# EAGLE schematic PIC32 (EAGLE 7.5.0)
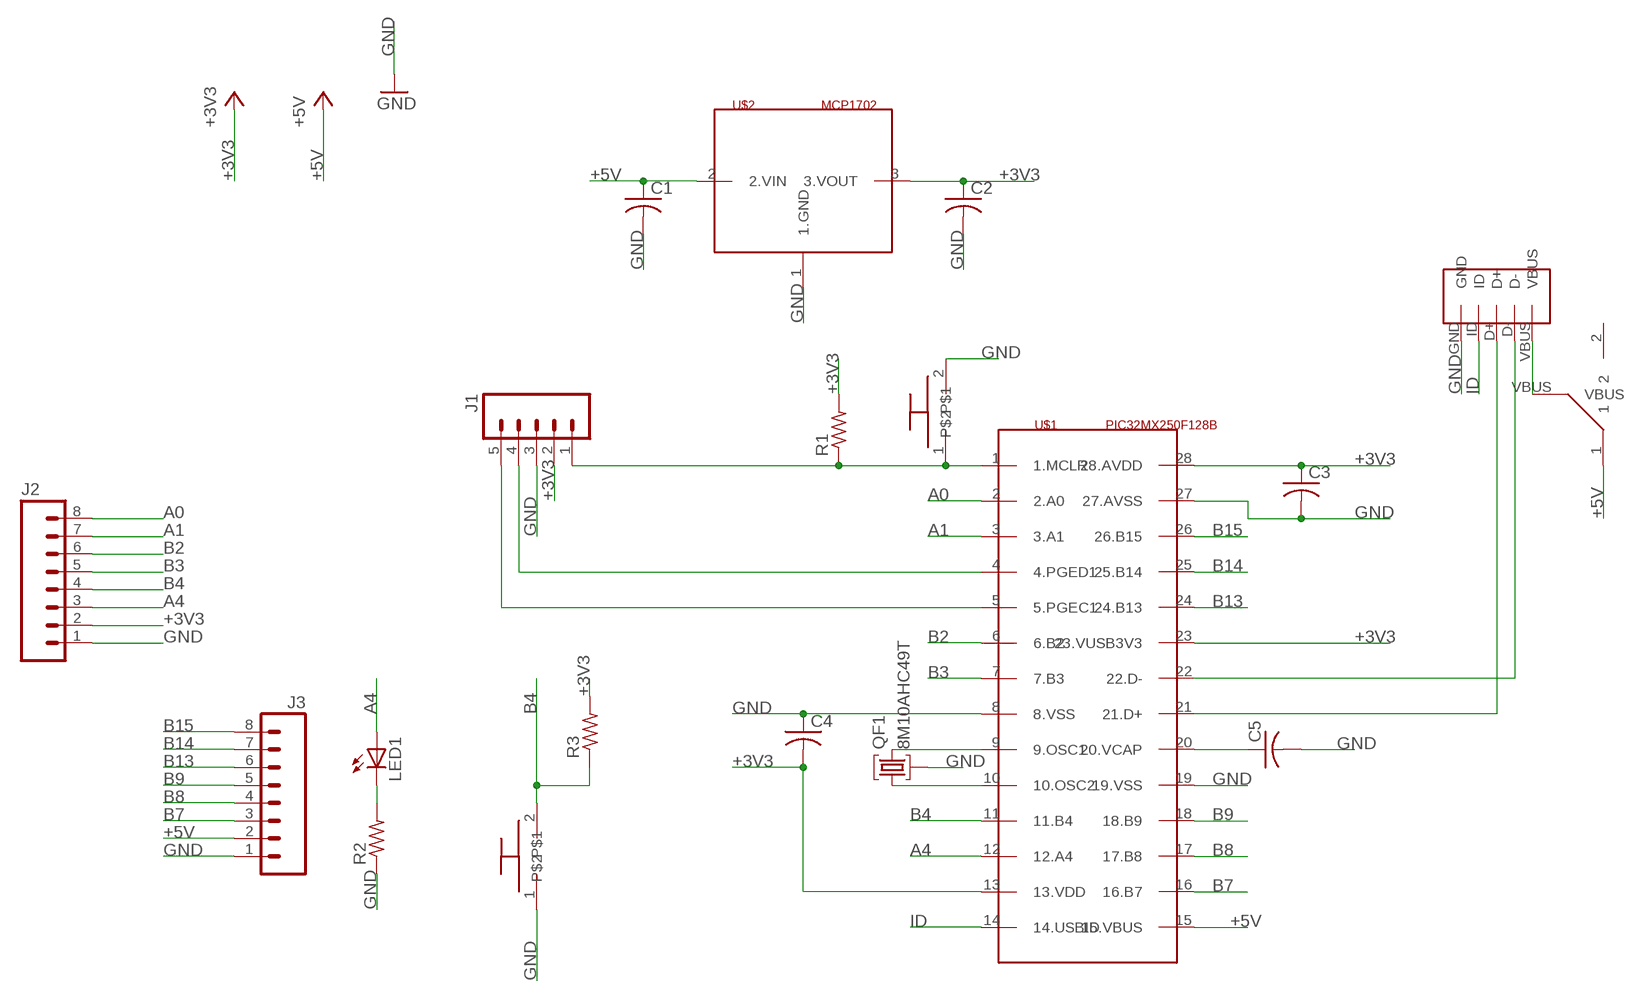
[diagram p0: schematic, sheet 1]

## Parts
C1  C-US025-024X044  [C025-024X044]
C2  C-US025-024X044  [C025-024X044]
C3  C-US025-024X044  [C025-024X044]
C4  C-US025-024X044  [C025-024X044]
C5  C-US025-030X050  [C025-030X050]
J1  M05PTH  [1X05]
J2  M08  [1X08_ROUND]
J3  M08  [1X08_ROUND]
LED1  LED3MM  [LED3MM]
QF1  8M10AHC49T  [HC49U]
R1  R-US_0207/10  [0207/10]
R2  R-US_0207/10  [0207/10]
R3  R-US_0207/10  [0207/10]
U$1  PIC32MX250F128B  [DIL28-3]
U$2  MCP1702  [TO92-EBC]
U$3  PUSHBUTTON  [PUSHBUTTON]
U$4  USB  [USB-MB-H]
U$5  PUSHBUTTON  [PUSHBUTTON]
U$6  SLIDESWITCH  [SLIDESWITCH]

## Nets
+3V3: C2.1 C3.1 C4.2 J1.2 J2.2 R1.2 R3.2 U$1.13(13.VDD) U$1.23(23.VUSB3V3) U$1.28(28.AVDD) U$2.3(3.VOUT)
+5V: C1.1 J3.2 U$1.15(15.VBUS) U$2.2(2.VIN) U$6.1
A0: J2.8 U$1.2(2.A0)
A1: J2.7 U$1.3(3.A1)
A4: J2.3 LED1.A U$1.12(12.A4)
B2: J2.6 U$1.6(6.B2)
B3: J2.5 U$1.7(7.B3)
B4: J2.4 R3.1 U$1.11(11.B4) U$5.2
B7: J3.3 U$1.16(16.B7)
B8: J3.4 U$1.17(17.B8)
B9: J3.5 U$1.18(18.B9)
B13: J3.6 U$1.24(24.B13)
B14: J3.7 U$1.25(25.B14)
B15: J3.8 U$1.26(26.B15)
GND: C1.2 C2.2 C3.2 C4.1 C5.2 J1.3 J2.1 J3.1 QF1.2 QF1.3 R2.1 U$1.8(8.VSS) U$1.9(9.OSC1) U$1.19(19.VSS) U$1.27(27.AVSS) U$2.1(1.GND) U$3.2 U$4.GND U$5.1
ID: U$1.14(14.USBID) U$4.ID
N$1: J1.1 R1.1 U$1.1(1.MCLR) U$3.1
N$2: J1.4 U$1.4(4.PGED1)
N$3: J1.5 U$1.5(5.PGEC1)
N$4: QF1.1 U$1.10(10.OSC2)
N$5: C5.1 U$1.20(20.VCAP)
N$6: LED1.K(C) R2.2
N$7: U$4.VBUS U$6.VBUS
N$9: U$1.21(21.D+) U$4.D+
N$10: U$1.22(22.D-) U$4.D-
Unconnected: U$6.2

## Library data of the parts
C1-C5 = ME433:C-US: CAPACITOR, American symbol
J1 = ME433:M05: Header 5 Standard 5-pin 0.1" header. Use with straight break away headers (SKU : PRT-00116), right angle break away headers (PRT-00553), swiss pins (PRT-00743), machine pins (PRT-00117), and female headers (PRT-00115). Molex polarized connector foot print use with SKU : PRT-08230 with associated crimp pins and housings.
J2 J3 = ME433:M08: Header 8 Standard 8-pin 0.1" header. Use with straight break away headers (SKU : PRT-00116), right angle break away headers (PRT-00553), swiss pins (PRT-00743), machine pins (PRT-00117), and female headers (PRT-00115).; PROD_ID: CONN-08437
LED1 = led:LED: LED OSRAM: - CHIPLED LG R971, LG N971, LY N971, LG Q971, LY Q971, LO R971, LY R971 LH N974, LH R974 LS Q976, LO Q976, LY Q976 LO Q996 - Hyper CHIPLED LW Q18S LB Q993, LB Q99A, LB R99A - SideLED LS A670, LO A670, LY A670, LG A670, LP A670 LB A673, LV A673, LT A673, LW A673 LH A674 LY A675 LS A676, LA A676, LO A676, LY A676, LW A676 LS A679, LY A679, LG A679 - Hyper Micro SIDELED® LS Y876, LA Y876, LO Y876, LY Y876 LT Y87S - SmartLED LW L88C, LW L88S LB L89C, LB L89S, LG L890 LS L89K, LO L89K, LY L89K LS L896, LA L896, LO L896, LY L896 - TOPLED LS T670, LO T670, LY T670, LG T670, LP T670 LSG T670, LSP T670, LSY T670, LOP T670, LYG T670 LG T671, LOG T671, LSG T671 LB T673, LV T673, LT T673, LW T673 LH T674 LS T676, LA T676, LO T676, LY T676, LB T676, LH T676, LSB T676, LW T676 LB T67C, LV T67C, LT T67C, LS T67K, LO T67K, LY T67K, LW E67C LS E67B, LA E67B, LO E67B, LY E67B, LB E67C, LV E67C, LT E67C LW T67C LS T679, LY T679, LG T679 LS T770, LO T770, LY T770, LG T770, LP T770 LB T773, LV T773, LT T773, LW T773 LH T774 LS E675, LA E675, LY E675, LS T675 LS T776, LA T776, LO T776, LY T776, LB T776 LHGB T686 LT T68C, LB T68C - Hyper Mini TOPLED® LB M676 - Mini TOPLED Santana® LG M470 LS M47K, LO M47K, LY M47K Source: http://www.osram.convergy.de LUXEON: - LUMILED® LXK2-PW12-R00, LXK2-PW12-S00, LXK2-PW14-U00, LXK2-PW14-V00 LXK2-PM12-R00, LXK2-PM12-S00, LXK2-PM14-U00 LXK2-PE12-Q00, LXK2-PE12-R00, LXK2-PE12-S00, LXK2-PE14-T00, LXK2-PE14-U00 LXK2-PB12-K00, LXK2-PB12-L00, LXK2-PB12-M00, LXK2-PB14-N00, LXK2-PB14-P00, LXK2-PB14-Q00 LXK2-PR12-L00, LXK2-PR12-M00, LXK2-PR14-Q00, LXK2-PR14-R00 LXK2-PD12-Q00, LXK2-PD12-R00, LXK2-PD12-S00 LXK2-PH12-R00, LXK2-PH12-S00 LXK2-PL12-P00, LXK2-PL12-Q00, LXK2-PL12-R00 Source: www.luxeon.com KINGBRIGHT: KA-3528ASYC Source: www.kingbright.com
QF1 = ME433:8M10AHC49T: Monolithic Crystal Filters Source: www.vanlong.com; OC_FARNELL: unknown; OC_NEWARK: unknown
R1-R3 = ME433:R-US_: RESISTOR, American symbol
U$1 = ME433:PIC32MX250F128B
U$2 = ME433:MCP1702
U$3 U$5 = ME433:PUSHBUTTON
U$4 = ME433:USB
U$6 = ME433:SLIDESWITCH